# Altium schematic sheet k26_baseboard_connectors2.SchDoc: k26 Baseboard Connectors 2
size A3; DrawnBy: Ch. Vogt; Engineer: Ch. Vogt; Organization: PBL; DocumentNumber: 1; Revision: r5; SheetNumber: 3
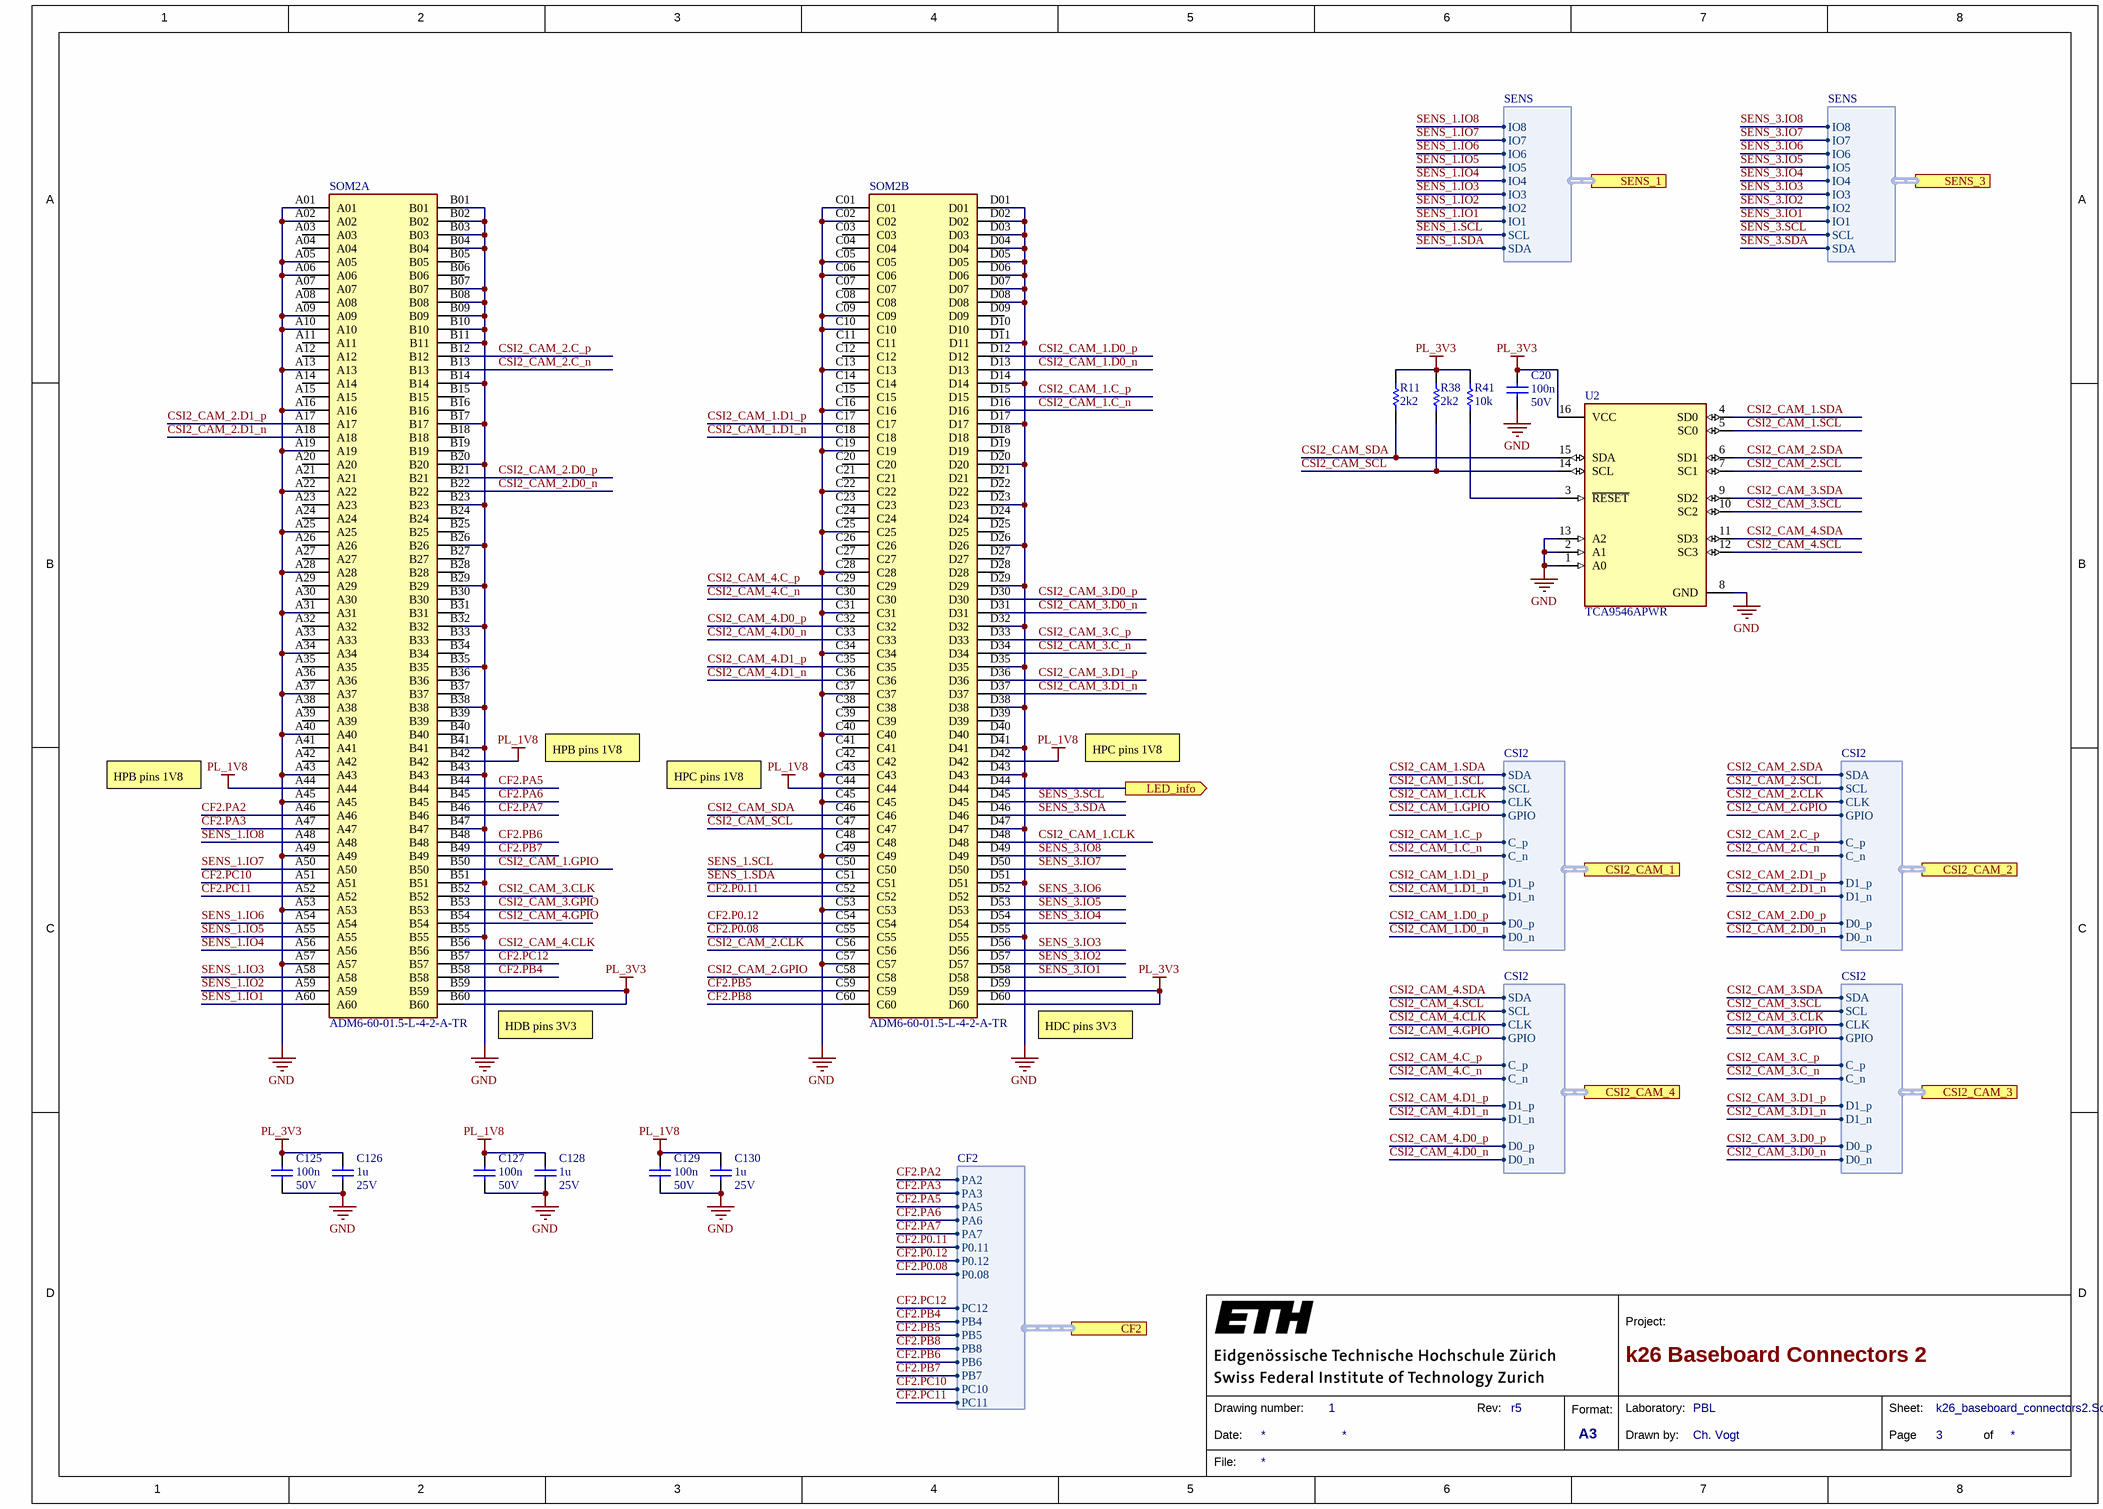
[diagram p0: k26_baseboard_connectors2.SchDoc]

## Parts
C20  100n  Rated DC Voltage (URdc): 50V  [CAPC0402]
C125  100n  Rated DC Voltage (URdc): 50V  [CAPC0402]
C126  1u  Rated DC Voltage (URdc): 25V  [CAPC0402]
C127  100n  Rated DC Voltage (URdc): 50V  [CAPC0402]
C128  1u  Rated DC Voltage (URdc): 25V  [CAPC0402]
C129  100n  Rated DC Voltage (URdc): 50V  [CAPC0402]
C130  1u  Rated DC Voltage (URdc): 25V  [CAPC0402]
R11  2k2  [RES0402]
R38  2k2  [RES0402]
R41  10k  [RES0402]
SOM2  ADM6-60-01.5-L-4-2-A-TR  [SAMTEC_ADM6-60-01.5-L-4-2-A-TR]  (parts A,B of 2)
U2  TCA9546APWR  [FP-PW0016A-MFG]

## Ports
CF2 (harness CF2), CSI2_CAM_1 (harness CSI2), CSI2_CAM_2 (harness CSI2), CSI2_CAM_3 (harness CSI2), CSI2_CAM_4 (harness CSI2), LED_info (out), SENS_1 (harness SENS), SENS_3 (harness SENS)

## Harnesses
CSI2: D0_n, D0_p, D1_n, D1_p, C_n, C_p, GPIO, CLK, SCL, SDA
SENS: SCL, SDA, IO1, IO2, IO3, IO4, IO5, IO6, IO7, IO8
CF2: PC11, PC10, PB7, PB6, PB8, PB5, PB4, PC12, P0.08, P0.12, P0.11, PA7, PA6, PA5, PA3, PA2

## Nets
GND: C20.1 C125.1 C126.1 C127.1 C128.1 C129.1 C130.1 SOM2.A01 SOM2.A02 SOM2.A05 SOM2.A06 SOM2.A09 SOM2.A10 SOM2.A13 SOM2.A16 SOM2.A19 SOM2.A22 SOM2.A25 SOM2.A28 SOM2.A31 SOM2.A34 SOM2.A37 SOM2.A40 SOM2.A43 SOM2.A45 SOM2.A49 SOM2.A53 SOM2.A57 SOM2.B01 SOM2.B02 SOM2.B03 SOM2.B04 SOM2.B07 SOM2.B08 SOM2.B09 SOM2.B10 SOM2.B11 SOM2.B14 SOM2.B17 SOM2.B20 SOM2.B23 SOM2.B26 SOM2.B29 SOM2.B32 SOM2.B35 SOM2.B38 SOM2.B41 SOM2.B43 SOM2.B47 SOM2.B51 SOM2.B55 SOM2.C01 SOM2.C02 SOM2.C05 SOM2.C06 SOM2.C09 SOM2.C10 SOM2.C13 SOM2.C16 SOM2.C19 SOM2.C22 SOM2.C25 SOM2.C28 SOM2.C31 SOM2.C34 SOM2.C37 SOM2.C40 SOM2.C43 SOM2.C45 SOM2.C49 SOM2.C53 SOM2.C57 SOM2.D01 SOM2.D02 SOM2.D03 SOM2.D04 SOM2.D05 SOM2.D06 SOM2.D07 SOM2.D08 SOM2.D11 SOM2.D14 SOM2.D17 SOM2.D20 SOM2.D23 SOM2.D26 SOM2.D29 SOM2.D32 SOM2.D35 SOM2.D38 SOM2.D41 SOM2.D43 SOM2.D47 SOM2.D51 SOM2.D55 U2.1(A0) U2.2(A1) U2.8(GND) U2.13(A2)
PL_1V8: C127.2 C128.2 C129.2 C130.2 SOM2.A44 SOM2.B42 SOM2.C44 SOM2.D42
PL_3V3: C20.2 C125.2 C126.2 R11.2 R38.2 R41.2 SOM2.B59 SOM2.B60 SOM2.D59 SOM2.D60 U2.16(VCC)
CF2.P0.08: SOM2.C55 ; port CF2.P0.08
CF2.P0.11: SOM2.C52 ; port CF2.P0.11
CF2.P0.12: SOM2.C54 ; port CF2.P0.12
CF2.PA2: SOM2.A46 ; port CF2.PA2
CF2.PA3: SOM2.A47 ; port CF2.PA3
CF2.PA5: SOM2.B44 ; port CF2.PA5
CF2.PA6: SOM2.B45 ; port CF2.PA6
CF2.PA7: SOM2.B46 ; port CF2.PA7
CF2.PB4: SOM2.B58 ; port CF2.PB4
CF2.PB5: SOM2.C59 ; port CF2.PB5
CF2.PB6: SOM2.B48 ; port CF2.PB6
CF2.PB7: SOM2.B49 ; port CF2.PB7
CF2.PB8: SOM2.C60 ; port CF2.PB8
CF2.PC10: SOM2.A51 ; port CF2.PC10
CF2.PC11: SOM2.A52 ; port CF2.PC11
CF2.PC12: SOM2.B57 ; port CF2.PC12
CSI2_CAM_1.C_n: SOM2.D16 ; port CSI2_CAM_1.C_n
CSI2_CAM_1.C_p: SOM2.D15 ; port CSI2_CAM_1.C_p
CSI2_CAM_1.CLK: SOM2.D48 ; port CSI2_CAM_1.CLK
CSI2_CAM_1.D0_n: SOM2.D13 ; port CSI2_CAM_1.D0_n
CSI2_CAM_1.D0_p: SOM2.D12 ; port CSI2_CAM_1.D0_p
CSI2_CAM_1.D1_n: SOM2.C18 ; port CSI2_CAM_1.D1_n
CSI2_CAM_1.D1_p: SOM2.C17 ; port CSI2_CAM_1.D1_p
CSI2_CAM_1.GPIO: SOM2.B50 ; port CSI2_CAM_1.GPIO
CSI2_CAM_1.SCL: U2.5(SC0) ; port CSI2_CAM_1.SCL
CSI2_CAM_1.SDA: U2.4(SD0) ; port CSI2_CAM_1.SDA
CSI2_CAM_2.C_n: SOM2.B13 ; port CSI2_CAM_2.C_n
CSI2_CAM_2.C_p: SOM2.B12 ; port CSI2_CAM_2.C_p
CSI2_CAM_2.CLK: SOM2.C56 ; port CSI2_CAM_2.CLK
CSI2_CAM_2.D0_n: SOM2.B22 ; port CSI2_CAM_2.D0_n
CSI2_CAM_2.D0_p: SOM2.B21 ; port CSI2_CAM_2.D0_p
CSI2_CAM_2.D1_n: SOM2.A18 ; port CSI2_CAM_2.D1_n
CSI2_CAM_2.D1_p: SOM2.A17 ; port CSI2_CAM_2.D1_p
CSI2_CAM_2.GPIO: SOM2.C58 ; port CSI2_CAM_2.GPIO
CSI2_CAM_2.SCL: U2.7(SC1) ; port CSI2_CAM_2.SCL
CSI2_CAM_2.SDA: U2.6(SD1) ; port CSI2_CAM_2.SDA
CSI2_CAM_3.C_n: SOM2.D34 ; port CSI2_CAM_3.C_n
CSI2_CAM_3.C_p: SOM2.D33 ; port CSI2_CAM_3.C_p
CSI2_CAM_3.CLK: SOM2.B52 ; port CSI2_CAM_3.CLK
CSI2_CAM_3.D0_n: SOM2.D31 ; port CSI2_CAM_3.D0_n
CSI2_CAM_3.D0_p: SOM2.D30 ; port CSI2_CAM_3.D0_p
CSI2_CAM_3.D1_n: SOM2.D37 ; port CSI2_CAM_3.D1_n
CSI2_CAM_3.D1_p: SOM2.D36 ; port CSI2_CAM_3.D1_p
CSI2_CAM_3.GPIO: SOM2.B53 ; port CSI2_CAM_3.GPIO
CSI2_CAM_3.SCL: U2.10(SC2) ; port CSI2_CAM_3.SCL
CSI2_CAM_3.SDA: U2.9(SD2) ; port CSI2_CAM_3.SDA
CSI2_CAM_4.C_n: SOM2.C30 ; port CSI2_CAM_4.C_n
CSI2_CAM_4.C_p: SOM2.C29 ; port CSI2_CAM_4.C_p
CSI2_CAM_4.CLK: SOM2.B56 ; port CSI2_CAM_4.CLK
CSI2_CAM_4.D0_n: SOM2.C33 ; port CSI2_CAM_4.D0_n
CSI2_CAM_4.D0_p: SOM2.C32 ; port CSI2_CAM_4.D0_p
CSI2_CAM_4.D1_n: SOM2.C36 ; port CSI2_CAM_4.D1_n
CSI2_CAM_4.D1_p: SOM2.C35 ; port CSI2_CAM_4.D1_p
CSI2_CAM_4.GPIO: SOM2.B54 ; port CSI2_CAM_4.GPIO
CSI2_CAM_4.SCL: U2.12(SC3) ; port CSI2_CAM_4.SCL
CSI2_CAM_4.SDA: U2.11(SD3) ; port CSI2_CAM_4.SDA
CSI2_CAM_SCL: R38.1 SOM2.C47 U2.14(SCL)
CSI2_CAM_SDA: R11.1 SOM2.C46 U2.15(SDA)
LED_info: SOM2.D44 ; port LED_info
SENS_1.IO1: SOM2.A60 ; port SENS_1.IO1
SENS_1.IO2: SOM2.A59 ; port SENS_1.IO2
SENS_1.IO3: SOM2.A58 ; port SENS_1.IO3
SENS_1.IO4: SOM2.A56 ; port SENS_1.IO4
SENS_1.IO5: SOM2.A55 ; port SENS_1.IO5
SENS_1.IO6: SOM2.A54 ; port SENS_1.IO6
SENS_1.IO7: SOM2.A50 ; port SENS_1.IO7
SENS_1.IO8: SOM2.A48 ; port SENS_1.IO8
SENS_1.SCL: SOM2.C50 ; port SENS_1.SCL
SENS_1.SDA: SOM2.C51 ; port SENS_1.SDA
SENS_3.IO1: SOM2.D58 ; port SENS_3.IO1
SENS_3.IO2: SOM2.D57 ; port SENS_3.IO2
SENS_3.IO3: SOM2.D56 ; port SENS_3.IO3
SENS_3.IO4: SOM2.D54 ; port SENS_3.IO4
SENS_3.IO5: SOM2.D53 ; port SENS_3.IO5
SENS_3.IO6: SOM2.D52 ; port SENS_3.IO6
SENS_3.IO7: SOM2.D50 ; port SENS_3.IO7
SENS_3.IO8: SOM2.D49 ; port SENS_3.IO8
SENS_3.SCL: SOM2.D45 ; port SENS_3.SCL
SENS_3.SDA: SOM2.D46 ; port SENS_3.SDA
NetR41_1: R41.1 U2.3(~{RESET})

Not connected (* = marked no-connect by the designer): SOM2 A03 A04 A07 A08 A11 A12 A14 A15 A20 A21 A23 A24 A26 A27 A29 A30 A32 A33 A35 A36 A38 A39 A41 A42 B05 B06 B15 B16 B18 B19 B24 B25 B27 B28 B30 B31 B33 B34 B36 B37 B39 B40 C03 C04 C07 C08 C11 C12 C14 C15 C20 C21 C23 C24 C26 C27 C38 C39 C41 C42 C48 D09 D10 D18 D19 D21 D22 D24 D25 D27 D28 D39 D40

## Notes on the sheet
- HPB pins 1V8
- HPC pins 1V8
- HDB pins 3V3
- HDC pins 3V3
- 1
- 2
- 3
- 4
- 5
- 6
- 7
- 8
- A
- B
- C
- D
- Project:
- Date:
- Drawing number:
- Rev:
- Format:
- A3
- Drawn by:
- Laboratory:
- Page
- Sheet:
- of
- File:

## Library data of the parts
C20 C125 C127 C129 = cap0402: Ceramic Capacitor, Multilayer, Ceramic, 50V, 10% +Tol, 10% -Tol, X5R, 15% TC, 0.1uF, Surface Mount, 0402; Manufacturer: Yageo; Manufacturer Part Number: CC0402KRX5R9BB104; Capacitance: 100nF; Multilayer: Yes; Supplier 1: Farnell; Supplier Part Number 1: 3366442; RoHS: Yes; Category: Ceramic Capacitors; Stock 1: 180000; Pricing 1: 10000=0.00890, 50000=0.00870 (CHF); Mount: Surface Mount; Number of Pins: 2; Dielectric Material: Ceramic; Package Shape: Rectangular; Size Code: 0402; Terminal Finish: Nickel; Min Operating Temperature: -55°C; Max Operating Temperature: 85°C; JESD-609 Code: e3; Capacitor Type: Ceramic; Negative Tolerance: 10%; Temperature Characteristics Code: X5R; Termination: Wraparound; Positive Tolerance: 10%; Package Style: SMTMeter; Packaging: Tape and Reel; Length: 1mm; Width: 0.5mm; Height: 0.5mm; Reach SVHC Compliant: Yes; RoHS Compliant: Yes; ComponentLink1URL: https://datasheet.ciiva.com:443/pdfs/VipMasterIC/IC/YAGO/YAGO-S-A0006851646/YAGO-S-A0006851646-1.pdf?src-supplier=IHS+Markit; ComponentLink1Description: https://datasheet.ciiva.com:443/pdfs/VipMasterIC/IC/YAGO/YAGO-S-A0006851646/YAGO-S-A0006851646-1.pdf?src-supplier=IHS+Markit; ComponentLink2URL: http://www.yageo.com/documents/recent/UPY-GPHC_X5R_4V-to-50V_25.pdf?src-supplier=Digi-Key; ComponentLink2Description: http://www.yageo.com/documents/recent/UPY-GPHC_X5R_4V-to-50V_25.pdf?src-supplier=Digi-Key; ComponentLink3URL: http://www.yageo.com/documents/recent/UPY-GPHC_X5R_4V-to-50V_23.pdf?src-supplier=Digi-Key; ComponentLink3Description: http://www.yageo.com/documents/recent/UPY-GPHC_X5R_4V-to-50V_23.pdf?src-supplier=Digi-Key
C126 C128 C130 = cap0402: Ceramic Capacitor, Multilayer, Ceramic, 25V, 20% +Tol, 20% -Tol, X5R, 15% TC, 1uF, Surface Mount, 0402; Manufacturer: Taiyo Yuden; Manufacturer Part Number: TMK105BJ105MV-F; Multilayer: Yes; Supplier: Rs; Supplier Part Number: 1843748; RoHS: Yes; Category: Ceramic Capacitors; Stock: 2400; Pricing: 200=0.05600, 600=0.05000, 1000=0.03900 (CHF); Mounting Technology: Surface Mount; Pins: 2; Dielectric Material: Ceramic; Case/Package: 0402; Package Shape: Rectangular; Terminal Finish: Nickel; Min Operating Temperature: -55°C; Max Operating Temperature: 85°C; Value: 1uF; Capacitor Type: Ceramic; Tolerance  (fill in as +-): 20%; Packaging: Tape and Reel; Tolerance (fill in as +-): 20%; Temperature Characteristics Code: X5R; Termination: Wraparound; Package Style: SMTMeter; JESD-609 Code: e3; Length: 1mm; Width: 0.5mm; Height: 0.5mm; Reach SVHC Compliant: Yes; RoHS Compliant: Yes; ComponentLink1URL: https://datasheet.ciiva.com:443/pdfs/VipMasterIC/IC/TAIY/TAIY-S-A0009103435/TAIY-S-A0009102669-1.pdf?src-supplier=IHS+Markit; ComponentLink1Description: https://datasheet.ciiva.com:443/pdfs/VipMasterIC/IC/TAIY/TAIY-S-A0009103435/TAIY-S-A0009102669-1.pdf?src-supplier=IHS+Markit; ComponentLink2URL: https://datasheet.ciiva.com/11596/tmk105bj105mv-f-ss-11596466.pdf?src-supplier=Avnet; ComponentLink2Description: https://datasheet.ciiva.com/11596/tmk105bj105mv-f-ss-11596466.pdf?src-supplier=Avnet; ComponentLink3URL: https://datasheet.ciiva.com/30154/128tmk105bj105mv-f-30154639.pdf?src-supplier=Onlinecomponents.com; ComponentLink3Description: https://datasheet.ciiva.com/30154/128tmk105bj105mv-f-30154639.pdf?src-supplier=Onlinecomponents.com; ComponentLink4URL: https://datasheet.ciiva.com/15922/tmk105bj105mv-f-pdf-15922317.pdf?src-supplier=Onlinecomponents.com; ComponentLink4Description: https://datasheet.ciiva.com/15922/tmk105bj105mv-f-pdf-15922317.pdf?src-supplier=Onlinecomponents.com; ComponentLink5URL: https://datasheet.ciiva.com/13404/mlcc-all-e-541559-13404206.pdf?src-supplier=Mouser; ComponentLink5Description: https://datasheet.ciiva.com/13404/mlcc-all-e-541559-13404206.pdf?src-supplier=Mouser
R11 R38 = res0402: Fixed Resistor, Metal Glaze/thick Film, 0.063W, 2200ohm, 50V, 1% +/-Tol, 100ppm/Cel, Surface Mount, 0402; Manufacturer: Vishay; Manufacturer Part Number: CRCW04022K20FKED; Power: 63mW; Value: 2.2kR; Temperature Coefficient: 100ppm/°C; Rated Temperature: 70°C; Package Height: 0.35mm; Package Length: 1mm; Package Width: 0.5mm; Reference Standard: AEC-Q200; Supplier: Farnell; Supplier Part Number: 2121643; RoHS: Yes; Category: Chip SMD Resistors; Stock: 30000; Pricing: 10000=0.00400, 50000=0.00390, 100000=0.00380 (CHF); Mounting Technology: Surface Mount; Pins: 2; Case/Package: 0402; Package Shape: Rectangular; Terminal Finish: Nickel; Min Operating Temperature: -55°C; Max Operating Temperature: 155°C; Tolerance: 1%; Resistor Type: FIXED RESISTOR; Termination: Wraparound; Packaging: Tape and Reel; Technology: METAL GLAZE/THICK FILM; Working Voltage: 50V; Package Style: SMTMeter; Construction: Chip; JESD-609 Code: e3; RoHS Compliant: Yes; Reach SVHC Compliant: Yes; ComponentLink1URL: https://datasheet.ciiva.com:443/pdfs/VipMasterIC/IC/VISH/VISH-S-A0007266705/VISH-S-A0007266705-1.pdf?src-supplier=IHS+Markit; ComponentLink1Description: https://datasheet.ciiva.com:443/pdfs/VipMasterIC/IC/VISH/VISH-S-A0007266705/VISH-S-A0007266705-1.pdf?src-supplier=IHS+Markit; ComponentLink2URL: https://datasheet.ciiva.com/11811/0900766b80d98824-11811709.pdf?src-supplier=Rs; ComponentLink2Description: https://datasheet.ciiva.com/11811/0900766b80d98824-11811709.pdf?src-supplier=Rs; ComponentLink3URL: https://datasheet.ciiva.com/3256/dcrcwe3-3256341.pdf?src-supplier=Avnet; ComponentLink3Description: https://datasheet.ciiva.com/3256/dcrcwe3-3256341.pdf?src-supplier=Avnet; ComponentLink4URL: https://datasheet.ciiva.com/16209/dcrcwe3-16209157.pdf?src-supplier=Future+Electronics; ComponentLink4Description: https://datasheet.ciiva.com/16209/dcrcwe3-16209157.pdf?src-supplier=Future+Electronics; ComponentLink5URL: https://datasheet.ciiva.com/2464/dcrcwe3-2464486.pdf?src-supplier=Digi-Key; ComponentLink5Description: https://datasheet.ciiva.com/2464/dcrcwe3-2464486.pdf?src-supplier=Digi-Key; ComponentLink6URL: https://datasheet.ciiva.com/2464/dcrcwe3-2464487.pdf?src-supplier=Digi-Key; ComponentLink6Description: https://datasheet.ciiva.com/2464/dcrcwe3-2464487.pdf?src-supplier=Digi-Key; ComponentLink7URL: https://datasheet.ciiva.com/2464/dcrcwe3-2464488.pdf?src-supplier=Digi-Key; ComponentLink7Description: https://datasheet.ciiva.com/2464/dcrcwe3-2464488.pdf?src-supplier=Digi-Key; ComponentLink8URL: https://datasheet.ciiva.com/5541/dcrcwe3-109170-5541416.pdf?src-supplier=Mouser; ComponentLink8Description: https://datasheet.ciiva.com/5541/dcrcwe3-109170-5541416.pdf?src-supplier=Mouser; ComponentLink9URL: https://datasheet.ciiva.com/26316/fld-crcw-e3-data-en-26316650.pdf?src-supplier=Distrelec; ComponentLink9Description: https://datasheet.ciiva.com/26316/fld-crcw-e3-data-en-26316650.pdf?src-supplier=Distrelec; ComponentLink10URL: https://datasheet.ciiva.com/7777/1697337-7777227.pdf?src-supplier=Element14; ComponentLink10Description: https://datasheet.ciiva.com/7777/1697337-7777227.pdf?src-supplier=Element14; ComponentLink11URL: https://datasheet.ciiva.com/7777/1697337-7777228.pdf?src-supplier=Element14; ComponentLink11Description: https://datasheet.ciiva.com/7777/1697337-7777228.pdf?src-supplier=Element14; ComponentLink12URL: https://datasheet.ciiva.com/16778/70201119-16778943.pdf?src-supplier=Allied+Electronics; ComponentLink12Description: https://datasheet.ciiva.com/16778/70201119-16778943.pdf?src-supplier=Allied+Electronics
R41 = res0402: Fixed Resistor, Metal Glaze/thick Film, 0.1W, 10000ohm, 50V, 1% +/-Tol, 100ppm/Cel, Surface Mount, 0402; Manufacturer: Panasonic; Manufacturer Part Number: ERJ-2RKF1002X; Power: 100mW; Value: 10kR; Temperature Coefficient: 100ppm/°C; Rated Temperature: 70°C; Package Height: 0.35mm; Package Length: 1mm; Package Width: 0.5mm; Reference Standard: AEC-Q200; Stock: 250000; Supplier: Rs; Supplier Part Number: 7325246; RoHS: Yes; Category: Chip SMD Resistors; Pricing: 10000=0.00600, 30000=0.00500 (CHF); Mounting Technology: Surface Mount; Pins: 2; Case/Package: 0402; Terminal Finish: Nickel; Package Shape: Rectangular; Min Operating Temperature: -55°C; Max Operating Temperature: 155°C; Tolerance: 1%; Resistor Type: FIXED RESISTOR; Technology: METAL GLAZE/THICK FILM; Termination: Wraparound; Working Voltage: 50V; Construction: Rectangular; Package Style: SMTMeter; Packaging: Tape and Reel; JESD-609 Code: e3; Reach SVHC Compliant: Yes; RoHS Compliant: Yes; ComponentLink1URL: https://datasheet.ciiva.com:443/pdfs/VipMasterIC/IC/PANA/PANA-S-A0009889626/PANA-S-A0009889626-1.pdf?src-supplier=IHS+Markit; ComponentLink1Description: https://datasheet.ciiva.com:443/pdfs/VipMasterIC/IC/PANA/PANA-S-A0009889626/PANA-S-A0009889626-1.pdf?src-supplier=IHS+Markit
SOM2 = ADM6-60-01.5-L-4-2-A-TR: 0.635 mm AcceleRate HD High-Density 4-Row Header; Package: None; Price: None; Value: *; MP: ADM6-60-01.5-L-4-2-A-TR; Availability: Unavailable
U2 = CMP-04892-000001-1: IC I2C SW 4CH W/RESET 16TSSOP; Manufacturer: Texas Instruments; Max Supply Voltage: 5.5V; Interface: I2C,SMBus; Standoff Height: 0.05mm; Min Supply Voltage: 1.65V; Nominal Supply Current: 2-50uA; Device Class L3: Multiplexers; Ambient Temperature Range Low: -40°C; Ambient Temperature Range High: +85°C; Mouser Description: Switch ICs - Various 4-Channel I2C and SMBus; Package: PW0016A; RoHS: TRUE; Device Class L2: Interface ICs; Temperature Range High: +85°C; Lead Free: Yes; Automotive: No; Temperature: -40°C to +85°C; Octopart: https://octopart.com/tca9546apwr-texas+instruments-22292132; ComponentLink2URL: http://www.ti.com/lit/ds/symlink/tca9546a.pdf; Digikey Description: IC I2C SW 4CH W/RESET 16TSSOP; Height: 1.2mm; Category: IC; Device Class L1: Integrated Circuits (ICs); ComponentLink2Description: Datasheet; Manufacturer Part Number: TCA9546APWR; Temperature Range Low: -40°C